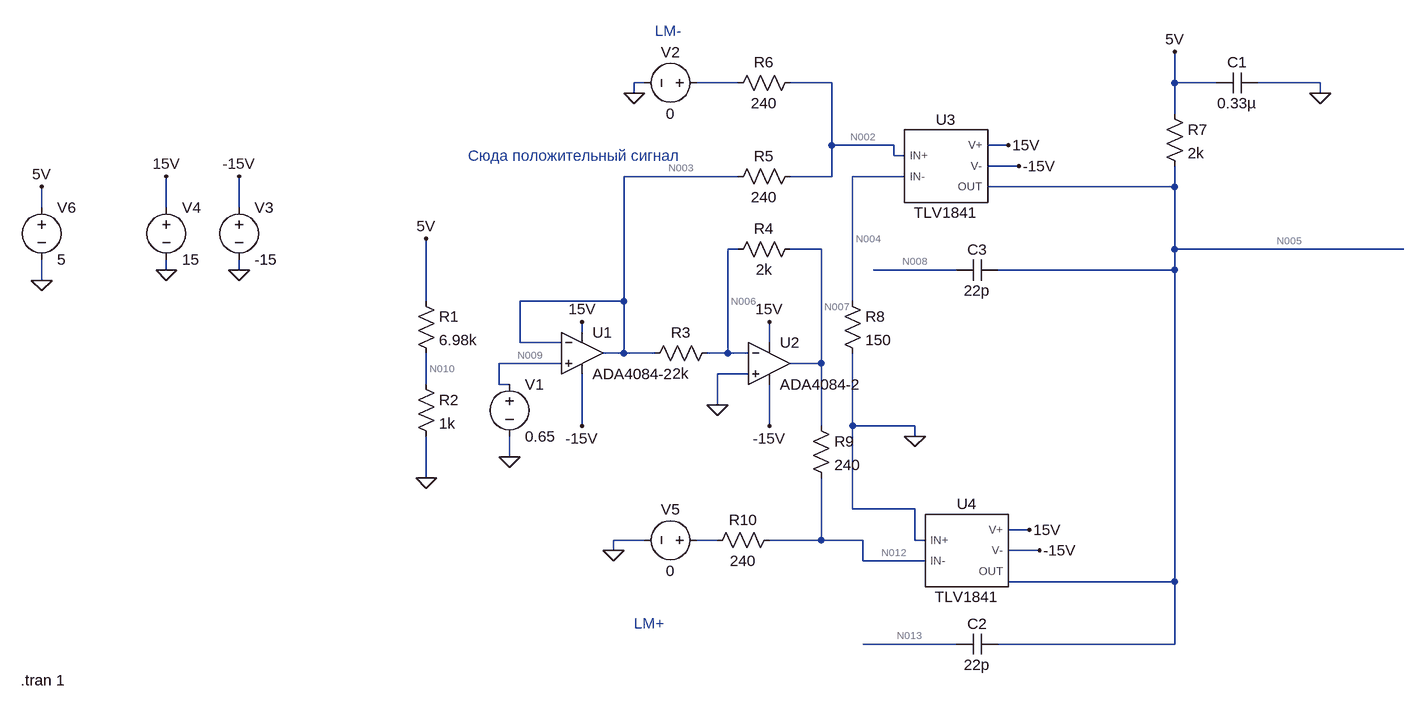
[diagram p0: schematic l1.asc]
l1.asc, the LTspice schematic file:
Version 4.1
SHEET 1 1604 784
WIRE 432 -240 416 -240
WIRE 576 -240 512 -240
WIRE 720 -240 656 -240
WIRE 1248 -240 1248 -288
WIRE 1312 -240 1248 -240
WIRE 1472 -240 1376 -240
WIRE 416 -224 416 -240
WIRE 1472 -224 1472 -240
WIRE 1248 -192 1248 -240
WIRE 720 -144 720 -240
WIRE 816 -144 720 -144
WIRE 992 -144 960 -144
WIRE 816 -128 816 -144
WIRE 832 -128 816 -128
WIRE 1008 -112 960 -112
WIRE 576 -96 400 -96
WIRE 720 -96 720 -144
WIRE 720 -96 656 -96
WIRE 832 -96 752 -96
WIRE 1248 -80 1248 -112
WIRE 1248 -80 960 -80
WIRE -496 -48 -496 -80
WIRE -304 -48 -304 -96
WIRE -192 -48 -192 -96
WIRE 576 16 560 16
WIRE 704 16 656 16
WIRE 1248 16 1248 -80
WIRE 1600 16 1248 16
WIRE -304 48 -304 32
WIRE -192 48 -192 32
WIRE 912 48 784 48
WIRE 1248 48 1248 16
WIRE 1248 48 976 48
WIRE -496 64 -496 32
WIRE 96 96 96 0
WIRE 400 96 400 -96
WIRE 400 96 240 96
WIRE 752 96 752 -96
WIRE 336 144 336 128
WIRE 240 160 240 96
WIRE 304 160 240 160
WIRE 624 160 624 128
WIRE 400 176 400 96
WIRE 400 176 368 176
WIRE 448 176 400 176
WIRE 560 176 560 16
WIRE 560 176 528 176
WIRE 592 176 560 176
WIRE 304 192 208 192
WIRE 704 192 704 16
WIRE 704 192 656 192
WIRE 592 208 544 208
WIRE 96 224 96 176
WIRE 208 224 208 192
WIRE 224 224 208 224
WIRE 544 256 544 208
WIRE 336 288 336 208
WIRE 624 288 624 224
WIRE 704 288 704 192
WIRE 752 288 752 176
WIRE 848 288 752 288
WIRE 848 304 848 288
WIRE 224 336 224 304
WIRE 96 368 96 304
WIRE 752 416 752 288
WIRE 848 416 752 416
WIRE 1024 448 992 448
WIRE 432 464 384 464
WIRE 544 464 512 464
WIRE 704 464 704 368
WIRE 704 464 624 464
WIRE 768 464 704 464
WIRE 848 464 848 416
WIRE 864 464 848 464
WIRE 384 480 384 464
WIRE 1040 480 992 480
WIRE 768 496 768 464
WIRE 864 496 768 496
WIRE 992 528 992 512
WIRE 1248 528 1248 48
WIRE 1248 528 992 528
WIRE 912 624 768 624
WIRE 1248 624 1248 528
WIRE 1248 624 976 624
FLAG 96 368 0
FLAG 544 256 0
FLAG 416 -224 0
FLAG -192 48 0
FLAG -304 48 0
FLAG -496 64 0
FLAG 1472 -224 0
FLAG -496 -80 5V
FLAG 1248 -288 5V
FLAG 848 304 0
FLAG -192 -96 -15V
FLAG -304 -96 15V
FLAG 992 -144 15V
FLAG 1008 -112 -15V
FLAG 96 0 5V
FLAG 336 128 15V
FLAG 624 128 15V
FLAG 336 288 -15V
FLAG 624 288 -15V
FLAG 224 336 0
FLAG 1024 448 15V
FLAG 1040 480 -15V
FLAG 384 480 0
DATAFLAG 704 416 ""
DATAFLAG 720 -128 ""
DATAFLAG 704 160 ""
DATAFLAG 400 -64 ""
SYMBOL res 80 80 R0
SYMATTR InstName R1
SYMATTR Value 6.98k
SYMBOL res 80 208 R0
SYMATTR InstName R2
SYMATTR Value 1k
SYMBOL OpAmps\\ADA4084-2 336 112 R0
SYMATTR InstName U1
SYMBOL OpAmps\\ADA4084-2 624 128 R0
SYMATTR InstName U2
SYMBOL res 544 160 R90
WINDOW 0 0 56 VBottom 2
WINDOW 3 32 56 VTop 2
SYMATTR InstName R3
SYMATTR Value 2k
SYMBOL res 672 0 R90
WINDOW 0 0 56 VBottom 2
WINDOW 3 32 56 VTop 2
SYMATTR InstName R4
SYMATTR Value 2k
SYMBOL res 672 -112 R90
WINDOW 0 0 56 VBottom 2
WINDOW 3 32 56 VTop 2
SYMATTR InstName R5
SYMATTR Value 240
SYMBOL res 672 -256 R90
WINDOW 0 0 56 VBottom 2
WINDOW 3 32 56 VTop 2
SYMATTR InstName R6
SYMATTR Value 240
SYMBOL voltage 528 -240 R90
WINDOW 0 -32 56 VBottom 2
WINDOW 3 32 56 VTop 2
WINDOW 123 0 0 Left 0
WINDOW 39 0 0 Left 0
SYMATTR InstName V2
SYMATTR Value 0
SYMBOL voltage -192 -64 R0
WINDOW 123 0 0 Left 0
WINDOW 39 0 0 Left 0
SYMATTR InstName V3
SYMATTR Value -15
SYMBOL voltage -304 -64 R0
WINDOW 123 0 0 Left 0
WINDOW 39 0 0 Left 0
SYMATTR InstName V4
SYMATTR Value 15
SYMBOL voltage -496 -64 R0
WINDOW 123 0 0 Left 0
WINDOW 39 0 0 Left 0
SYMATTR InstName V6
SYMATTR Value 5
SYMBOL res 1232 -208 R0
SYMATTR InstName R7
SYMATTR Value 2k
SYMBOL cap 1376 -256 R90
WINDOW 0 0 32 VBottom 2
WINDOW 3 32 32 VTop 2
SYMATTR InstName C1
SYMATTR Value 0.33µ
SYMBOL res 736 80 R0
SYMATTR InstName R8
SYMATTR Value 150
SYMBOL cap 976 32 R90
WINDOW 0 0 32 VBottom 2
WINDOW 3 32 32 VTop 2
SYMATTR InstName C3
SYMATTR Value 22p
SYMBOL TLV1841 896 -112 R0
SYMATTR InstName U3
SYMBOL voltage 224 208 R0
WINDOW 123 0 0 Left 0
WINDOW 39 0 0 Left 0
SYMATTR InstName V1
SYMATTR Value 0.65
SYMBOL TLV1841 928 480 R0
SYMATTR InstName U4
SYMBOL cap 976 608 R90
WINDOW 0 0 32 VBottom 2
WINDOW 3 32 32 VTop 2
SYMATTR InstName C2
SYMATTR Value 22p
SYMBOL res 688 272 R0
SYMATTR InstName R9
SYMATTR Value 240
SYMBOL voltage 528 464 R90
WINDOW 0 -32 56 VBottom 2
WINDOW 3 32 56 VTop 2
WINDOW 123 0 0 Left 0
WINDOW 39 0 0 Left 0
SYMATTR InstName V5
SYMATTR Value 0
SYMBOL res 640 448 R90
WINDOW 0 0 56 VBottom 2
WINDOW 3 32 56 VTop 2
SYMATTR InstName R10
SYMATTR Value 240
TEXT -528 680 Left 2 !.tran 1
TEXT 160 -128 Left 2 ;Сюда положительный сигнал
TEXT 416 592 Left 2 ;LM+
TEXT 448 -320 Left 2 ;LM-

The netlist it stands for:
* l1.asc
R1 5V N010 6.98k
R2 N010 0 1k
X§U1 N009 N003 15V -15V N003 ADA4084-2  ; pins In+ In- V+ V- OUT
X§U2 0 N006 15V -15V N007 ADA4084-2  ; pins In+ In- V+ V- OUT
R3 N006 N003 2k
R4 N007 N006 2k
R5 N002 N003 240
R6 N002 N001 240
V2 N001 0 0
V3 -15V 0 -15
V4 15V 0 15
V6 5V 0 5
R7 5V N005 2k
C1 0 5V 0.33µ
R8 N004 0 150
C3 N005 N008 22p
X§U3 N002 N004 15V -15V N005 TLV1841  ; pins IN+ IN- V+ V- OUT
V1 N009 0 0.65
X§U4 0 N012 15V -15V N005 TLV1841  ; pins IN+ IN- V+ V- OUT
C2 N005 N013 22p
R9 N007 N012 240
V5 N011 0 0
R10 N012 N011 240
.tran 1
* Сюда положительный сигнал
* LM+
* LM-
.lib C:\Users\User\Documents\LTspice\tlv1841.lib
.backanno
.end

* Results of the author's LTspice run, read from the files saved beside the schematic
* Operating Point, zero values left out:
*   V(n010) = 626.6 mV
*   V(n003) = 649.9 mV
*   V(15v) = 15 V
*   V(n006) = -50.94 µV
*   V(n004) = -75 nV
*   V(n008) = 5 V
*   V(n013) = 5 V
*   V(5v) = 5 V
*   V(n009) = 650 mV
*   V(-15v) = -15 V
*   V(n007) = -650.3 mV
*   V(n002) = 325 mV
*   V(n005) = 5 V
*   V(n012) = -325.2 mV
*   I(R4) = -325.1 µA
*   I(R6) = 1.354 mA
*   I(V1) = 122.5 nA
*   I(R9) = -1.355 mA
*   I(R10) = -1.355 mA
*   I(R1) = 626.6 µA
*   I(V2) = 1.354 mA
*   I(V4) = -1.399 mA
*   I(R2) = 626.6 µA
*   I(R3) = -325 µA
*   I(R5) = -1.354 mA
*   I(R7) = 100.3 pA
*   I(R8) = -500 pA
*   I(V5) = -1.355 mA
*   I(V3) = 1.399 mA
*   I(V6) = -626.6 µA